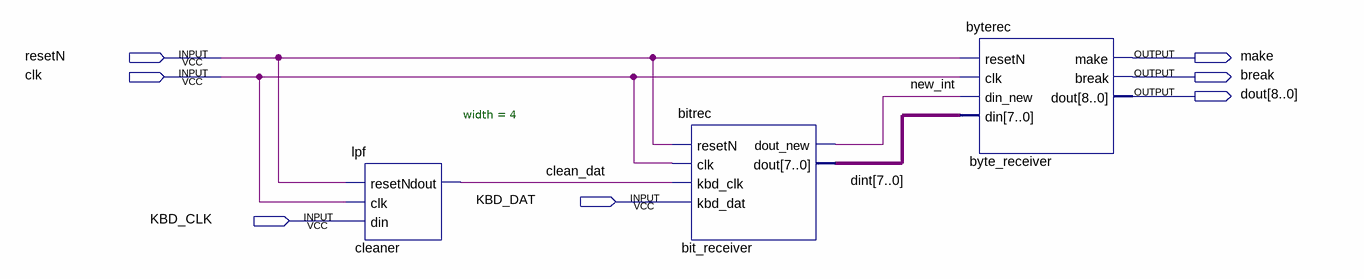
[diagram p0: schematic sheet]
// Quartus schematic KBD.bdf as structural Verilog: 3 symbols, 7 pins
module KBD (
  input  resetN,
  input  clk,
  input  KBD_DAT,
  input  KBD_CLK,
  output make,
  output \break ,
  output [8:0] dout
);

  wire clean_dat, new_int;
  wire [7:0] dint;

  lpf #(.width(4)) cleaner (.resetN(resetN), .clk(clk), .din(KBD_CLK), .dout(clean_dat));
  bitrec bit_receiver (
    .resetN(resetN), .clk(clk), .kbd_clk(clean_dat), .kbd_dat(KBD_DAT), .dout_new(new_int), .dout(dint));
  byterec byte_receiver (
    .resetN(resetN), .clk(clk), .din_new(new_int), .din(dint), .make(make), .\break (\break ), .dout(dout));
endmodule
